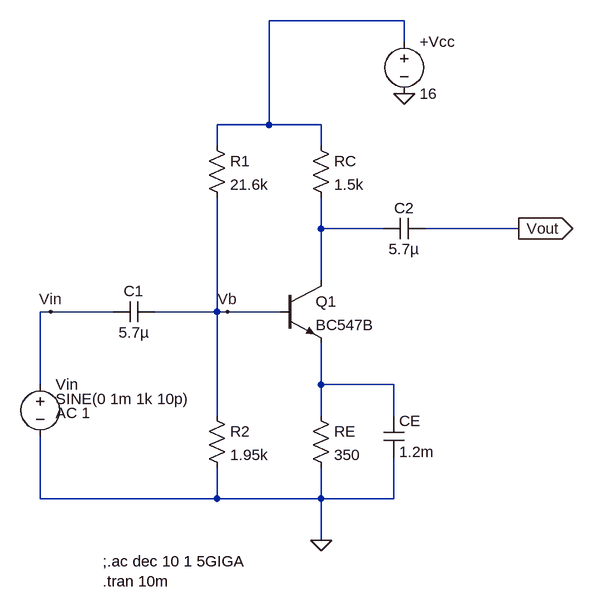
[diagram p0: schematic RC_Coupled_amp_Final copy.asc]
RC_Coupled_amp_Final copy.asc, the LTspice schematic file:
Version 4
SHEET 1 880 740
WIRE 544 -128 336 -128
WIRE 544 -96 544 -128
WIRE 336 32 336 -128
WIRE 336 32 256 32
WIRE 416 32 336 32
WIRE 256 64 256 32
WIRE 416 64 416 32
WIRE 416 192 416 144
WIRE 512 192 416 192
WIRE 720 192 576 192
WIRE 416 272 416 192
WIRE 0 320 -16 320
WIRE 96 320 0 320
WIRE 256 320 256 144
WIRE 256 320 160 320
WIRE 272 320 256 320
WIRE 352 320 272 320
WIRE -16 432 -16 320
WIRE 416 432 416 368
WIRE 528 432 416 432
WIRE 256 480 256 320
WIRE 416 480 416 432
WIRE 528 480 528 432
WIRE -16 608 -16 512
WIRE 256 608 256 560
WIRE 256 608 -16 608
WIRE 416 608 416 560
WIRE 416 608 256 608
WIRE 528 608 528 544
WIRE 528 608 416 608
WIRE 416 672 416 608
FLAG 544 -16 0
FLAG 416 672 0
FLAG 272 320 Vb
FLAG 720 192 Vout
IOPIN 720 192 Out
FLAG 0 320 Vin
SYMBOL npn 352 272 R0
SYMATTR InstName Q1
SYMATTR Value BC547B
SYMBOL res 240 48 R0
SYMATTR InstName R1
SYMATTR Value 21.6k
SYMBOL res 400 48 R0
SYMATTR InstName RC
SYMATTR Value 1.5k
SYMBOL res 240 464 R0
SYMATTR InstName R2
SYMATTR Value 1.95k
SYMBOL res 400 464 R0
SYMATTR InstName RE
SYMATTR Value 350
SYMBOL cap 576 176 R90
WINDOW 0 0 32 VBottom 2
WINDOW 3 32 32 VTop 2
SYMATTR InstName C2
SYMATTR Value 5.7µ
SYMBOL cap 512 480 R0
SYMATTR InstName CE
SYMATTR Value 1.2m
SYMBOL cap 160 304 R90
WINDOW 0 0 32 VBottom 2
WINDOW 3 32 32 VTop 2
SYMATTR InstName C1
SYMATTR Value 5.7µ
SYMBOL voltage -16 416 R0
WINDOW 3 24 38 Left 2
WINDOW 123 24 60 Left 2
SYMATTR Value SINE(0 1m 1k 10p)
SYMATTR Value2 AC 1
SYMATTR InstName Vin
SYMBOL voltage 544 -112 R0
SYMATTR InstName +Vcc
SYMATTR Value 16
TEXT 80 704 Left 2 !;.ac dec 10 1 5GIGA\n.tran 10m

The netlist it stands for:
* RC_Coupled_amp_Final copy.asc
Q1 N002 Vb N003 0 BC547B
R1 N001 Vb 21.6k
RC N001 N002 1.5k
R2 Vb 0 1.95k
RE N003 0 350
C2 Vout N002 5.7µ
CE N003 0 1.2m
C1 Vb Vin 5.7µ
Vin Vin 0 SINE(0 1m 1k 10p) AC 1
V§+Vcc N001 0 16
.model NPN NPN
.model PNP PNP
.lib standard.bjt
;.ac dec 10 1 5GIGA
.tran 10m
.backanno
.end